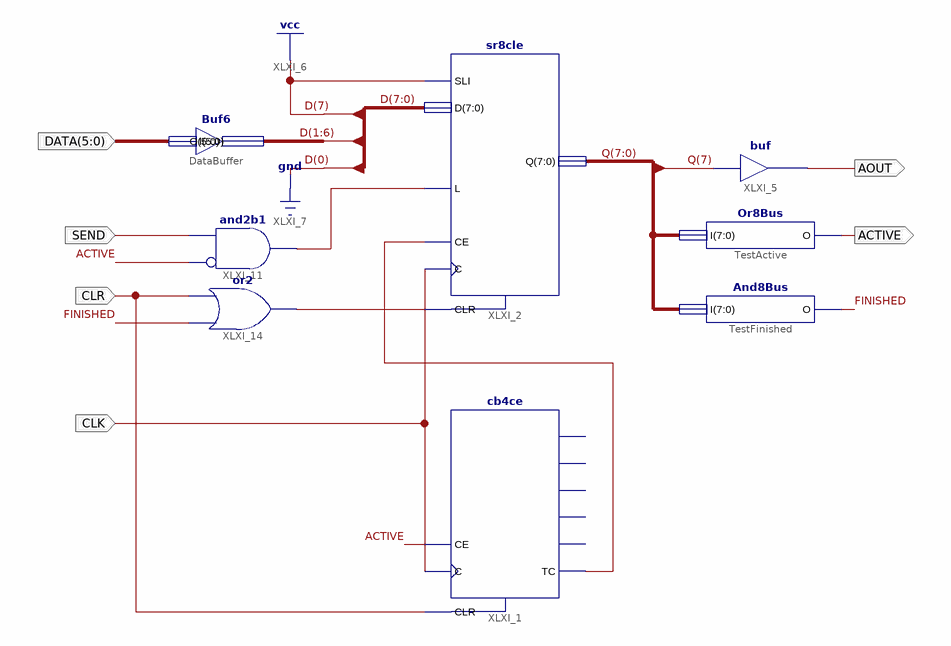
[diagram p0: schematic sheet 1]
// Xilinx ISE schematic AsyncTx.sch (xc9500xl) as structural Verilog: 8 symbols, 6 ports
module AsyncTx (
  input  SEND,
  input  CLR,
  input  CLK,
  input  [5:0] DATA,
  output AOUT,
  output ACTIVE
);

  wire FINISHED, XLXN_16, XLXN_22, XLXN_26;
  wire [6:1] D;
  wire [7:0] Q;

  sr8cle XLXI_2 (.C(CLK), .CE(XLXN_22), .CLR(XLXN_26), .D({1'b1, D, 1'b0}), .L(XLXN_16), .SLI(1'b1), .Q(Q));
  buf XLXI_5 (AOUT, Q[7]);
  Or8Bus TestActive (.I(Q), .O(ACTIVE));
  cb4ce XLXI_1 (.C(CLK), .CE(ACTIVE), .CLR(CLR), .TC(XLXN_22));  // open: CEO, Q0, Q1, Q2, Q3
  and XLXI_11 (XLXN_16, ~ACTIVE, SEND);  // and2b1
  or XLXI_14 (XLXN_26, FINISHED, CLR);
  Buf6 DataBuffer (.I(DATA), .O({D[1], D[2], D[3], D[4], D[5], D[6]}));
  And8Bus TestFinished (.I(Q), .O(FINISHED));
endmodule
